# Altium schematic sheet BlockUIAffichage.SchDoc: <title>
size A4; Organization: Institut d'Automatisation Industrielle; SheetNumber: 6; SheetTotal: 8; SVN: OUI; CurrentTime: 6; CurrentDate: 5; DocumentFullPathAndName: 8; DocumentName: 9; ModifiedDate: 13; ProjectName: <projet>
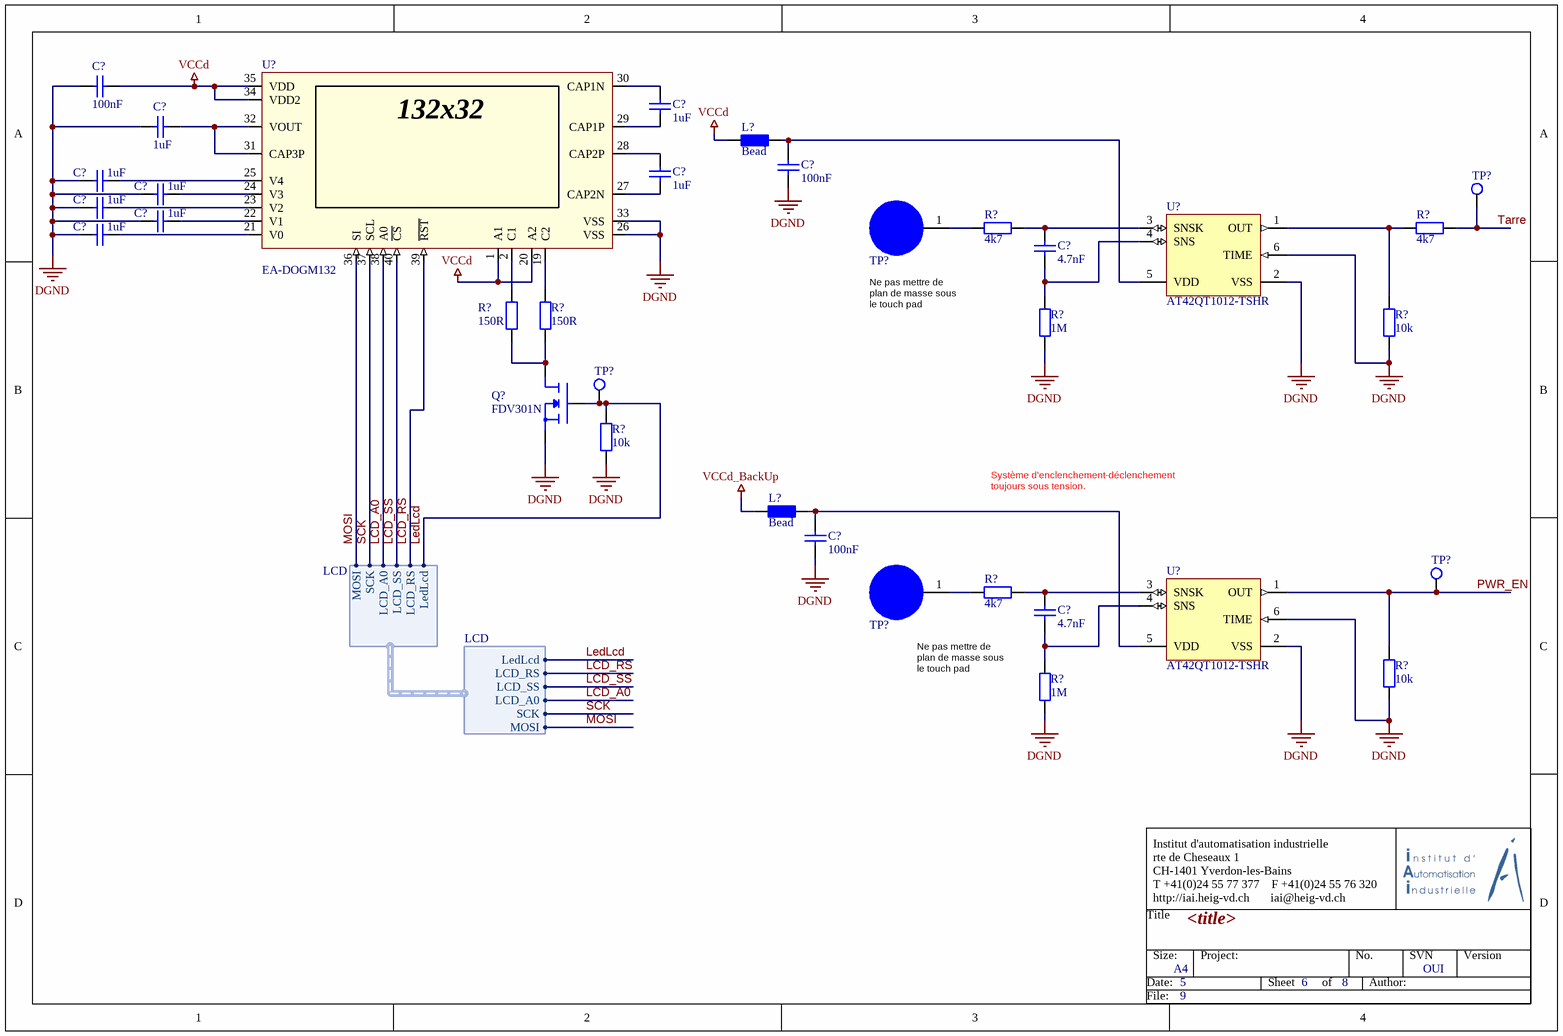
[diagram p0: BlockUIAffichage.SchDoc]

## Parts
(Parts that share a designator on the sheet are numbered #1, #2 ... from top to bottom, then left to right.)
C?#1  100nF  [CAPC2012N]
C?#2  1uF  [CAPC2012N]
C?#3  1uF  [CAPC2012N]
C?#4  1uF  [CAPC2012N]
C?#5  100nF  [CAPC2012N]
C?#6  1uF  [CAPC2012N]
C?#7  1uF  [CAPC2012N]
C?#8  1uF  [CAPC2012N]
C?#9  1uF  [CAPC2012N]
C?#10  1uF  [CAPC2012N]
C?#11  4.7nF  [CAPC2012N]
C?#12  100nF  [CAPC2012N]
C?#13  4.7nF  [CAPC2012N]
L?#1  Bead  [RESC2012N]
L?#2  Bead  [RESC2012N]
Q?  FDV301N  [SOT23-3N]
R?#1  4k7  [RESC2012N]
R?#2  4k7  [RESC2012N]
R?#3  150R  [RESC2012N]
R?#4  150R  [RESC2012N]
R?#5  1M  [RESC2012N]
R?#6  10k  [RESC2012N]
R?#7  10k  [RESC2012N]
R?#8  4k7  [RESC2012N]
R?#9  10k  [RESC2012N]
R?#10  1M  [RESC2012N]
TP?#1  TP  [Testpoint]  (value not drawn)
TP?#2  TouchPad10mm  [TouchPad10mm]  (value not drawn)
TP?#3  TP  [Testpoint]  (value not drawn)
TP?#4  TouchPad10mm  [TouchPad10mm]  (value not drawn)
TP?#5  TP  [Testpoint]  (value not drawn)
U?#1  AT42QT1012-TSHR  [SOT-23-6]
U?#2  EA-DOGM132  [EA_DOGM132_WITH_BACKLIGHT]
U?#3  AT42QT1012-TSHR  [SOT-23-6]

## Harnesses
LCD: LCD_RS, LCD_SS, MOSI, SCK, LedLcd, LCD_A0

## Nets
DGND: C?#1.1 C?#2.1 C?#4.1 C?#5.1 C?#6.1 C?#8.1 C?#9.1 C?#10.1 C?#12.1 Q?.2(S) R?#5.1 R?#6.1 R?#7.1 R?#9.1 R?#10.1 U?#1.2(VSS) U?#1.6(TIME) U?#2.26(VSS) U?#2.33(VSS) U?#3.2(VSS) U?#3.6(TIME)
VCCd: C?#1.2 L?#1.1 U?#2.1(A1) U?#2.20(A2) U?#2.34(VDD2) U?#2.35(VDD)
VCCd_BackUp: L?#2.1
LCD_A0: U?#2.38(A0) ; harness LCD.LCD_A0
LCD_RS: U?#2.39(~{RST}) ; harness LCD.LCD_RS
LCD_SS: U?#2.40(~{CS}) ; harness LCD.LCD_SS
LedLcd: Q?.1(G) R?#7.2 TP?#3.1 ; harness LCD.LedLcd
MOSI: U?#2.36(SI) ; harness LCD.MOSI
PWR_EN: R?#9.2 TP?#5.1 U?#3.1(OUT)
SCK: U?#2.37(SCL) ; harness LCD.SCK
Tarre: R?#2.2 TP?#1.1
NetC?#2_2: C?#2.2 U?#2.31(CAP3P) U?#2.32(VOUT)
NetC?#3_1: C?#3.1 U?#2.29(CAP1P)
NetC?#3_2: C?#3.2 U?#2.30(CAP1N)
NetC?#4_2: C?#4.2 U?#2.25(V4)
NetC?#5_2: C?#5.2 L?#1.2 U?#1.5(VDD)
NetC?#6_2: C?#6.2 U?#2.24(V3)
NetC?#7_1: C?#7.1 U?#2.27(CAP2N)
NetC?#7_2: C?#7.2 U?#2.28(CAP2P)
NetC?#8_2: C?#8.2 U?#2.23(V2)
NetC?#9_2: C?#9.2 U?#2.22(V1)
NetC?#10_2: C?#10.2 U?#2.21(V0)
NetC?#11_1: C?#11.1 R?#5.2 U?#1.4(SNS)
NetC?#11_2: C?#11.2 R?#1.2 U?#1.3(SNSK)
NetC?#12_2: C?#12.2 L?#2.2 U?#3.5(VDD)
NetC?#13_1: C?#13.1 R?#10.2 U?#3.4(SNS)
NetC?#13_2: C?#13.2 R?#8.2 U?#3.3(SNSK)
NetQ?_3: Q?.3(D) R?#3.1 R?#4.1
NetR?#1_1: R?#1.1 TP?#2.1
NetR?#2_1: R?#2.1 R?#6.2 U?#1.1(OUT)
NetR?#3_2: R?#3.2 U?#2.2(C1)
NetR?#4_2: R?#4.2 U?#2.19(C2)
NetR?#8_1: R?#8.1 TP?#4.1

## Notes on the sheet
- Ne pas mettre de
  plan de masse sous
  le touch pad
- Système d'enclenchement-déclenchement
  toujours sous tension.
- Title
- Institut d'automatisation industrielle
  rte de Cheseaux 1
  CH-1401 Yverdon-les-Bains
  T +41(0)24 55 77 377    F +41(0)24 55 76 320
  http://iai.heig-vd.ch       iai@heig-vd.ch
- Date:
- Size:
- A4
- Project:
- Sheet
- of
- No.
- Author:
- SVN
- Version
- File:
- (in symbol DOGM_132-5) 132x32

## Library data of the parts
C?#1 C?#5 C?#12 = Cap_100nF: Capacitor; Value: 100nF; Supplier 1: Digi-Key; Supplier Part Number 1: 478-1395-1-ND
C?#2-C?#4 C?#6-C?#10 = Cap_1uF: Capacitor; Value: 1uF; Supplier 1: Digi-Key; Supplier Part Number 1: 490-10743-1-ND
C?#11 C?#13 = Cap_4.7nF: Capacitor; Value: 4.7nF; Supplier 1: Digi-Key; Supplier Part Number 1: 311-1431-1-ND
R?#1 R?#2 R?#8 = Res_4k7: Resistor; Value: 4k7; Supplier 1: Digi-Key; Supplier Part Number 1: 311-4.70KCRCT-ND
R?#3 R?#4 = Res_150R: Resistor; Value: 150R; Supplier 1: Digi-Key; Supplier Part Number 1: 311-150CRCT-ND
R?#5 R?#10 = Res_1M: Resistor; Value: 1M; Supplier 1: Digi-Key; Supplier Part Number 1: 311-1.00MCRCT-ND
R?#6 R?#7 R?#9 = Res_10k: Resistor; Value: 10k; Supplier 1: Digi-Key; Supplier Part Number 1: 311-10.0KCRCT-ND
TP?#1 TP?#3 TP?#5 = TP: =Value; Supplier 1: Digi-Key; Supplier Part Number 1: 36-5006-ND
U?#1 U?#3 = AT42QT1012-TSHR: One-channel Toggle-mode Touch Sensor IC with Power Management Functions, -40° to +85° C, 6-pin SOT23; DatasheetVersion: revD, Aug-2010; PackageVersion: revA, Jun-2008; PackageReference: 6ST1; PackageDescription: 6-Lead, 2.90 x 1.60 mm Plastic Small Outline Package (SOT23); Code_JEDEC: MO-178-AB; Code_IPC: SOT26A-6; ComponentLink1Description: Manufacturer URL; ComponentLink1URL: http://www.atmel.com/; ComponentLink2Description: Datasheet; ComponentLink2URL: http://www.atmel.com/Images/doc9543.pdf; Supplier 1: Digi-Key; Supplier Part Number 1: AT42QT1012-TSHRCT-ND
U?#2 = DOGM_132-5: Chip On Glass Graphic LCD; Value: EA-DOGM132
L?#1 L?#2 = Bead: Value: Bead; Supplier 1: Digi-Key; Supplier Part Number 1: 240-2399-1-ND
Q? = FDV301N: Value: FDV301N; Supplier 1: Digi-Key; Supplier Part Number 1: FDV301NCT-ND